# Altium schematic sheet MainSheet.SchDoc
size C
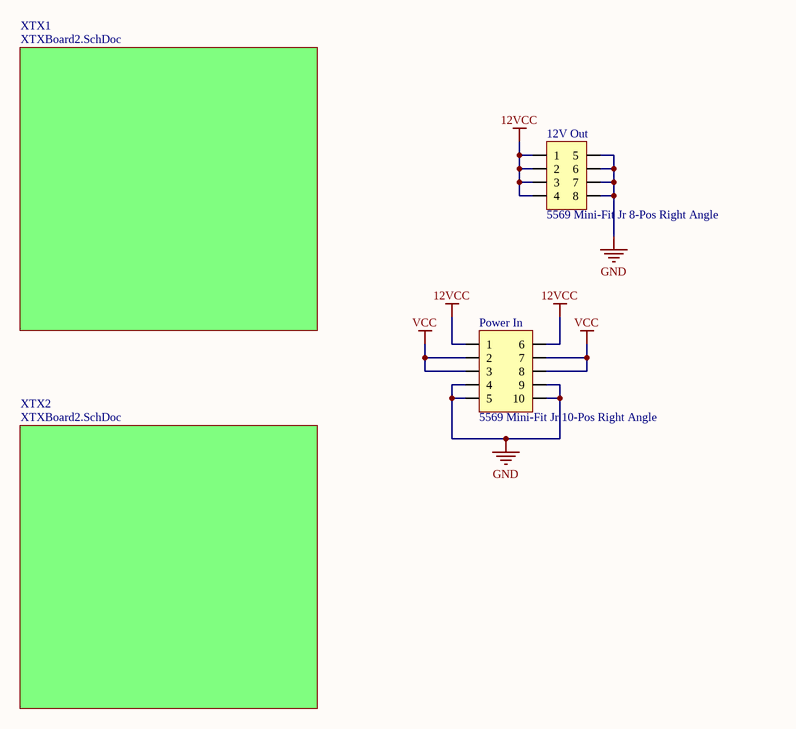
[diagram p0: MainSheet.SchDoc]

## Parts
12V_Out  5569 Mini-Fit Jr 8-Pos Right Angle  [8-POS 5569 Mini-Fit Jr 2]
Power_In  5569 Mini-Fit Jr 10-Pos Right Angle  [10-Pos 5569 Mini-Fit Jr 2]

## Sub-sheets
XTX1 = XTXBoard2.SchDoc: no entries
XTX2 = XTXBoard2.SchDoc: no entries

## Nets
12VCC: 12V_Out.1 12V_Out.2 12V_Out.3 12V_Out.4 Power_In.1 Power_In.6
GND: 12V_Out.5 12V_Out.6 12V_Out.7 12V_Out.8 Power_In.4 Power_In.5 Power_In.9 Power_In.10
VCC: Power_In.2 Power_In.3 Power_In.7 Power_In.8